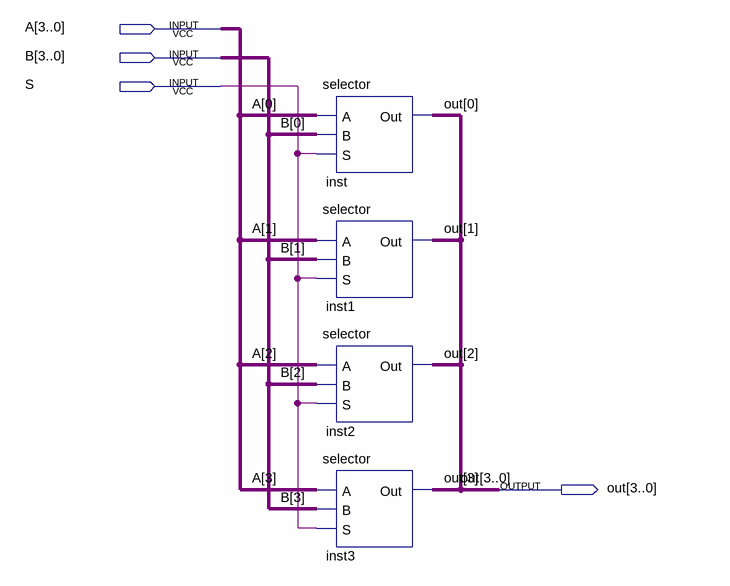
[diagram p0: schematic sheet]
// Quartus schematic selector4b.bdf as structural Verilog: 4 symbols, 4 pins
module selector4b (
  input  [3:0] A,
  input  [3:0] B,
  input  S,
  output [3:0] out
);

  selector inst (.A(A[0]), .B(B[0]), .S(S), .Out(out[0]));
  selector inst1 (.A(A[1]), .B(B[1]), .S(S), .Out(out[1]));
  selector inst2 (.A(A[2]), .B(B[2]), .S(S), .Out(out[2]));
  selector inst3 (.A(A[3]), .B(B[3]), .S(S), .Out(out[3]));
endmodule
